# Altium schematic sheet dcshift.SchDoc: Signal Path DC Shift
size A4; Organization: Altium Limited; Address1: L3, 12a Rodborough Rd; Address2: Frenchs Forest; Address3: NSW; Address4: Australia 2086
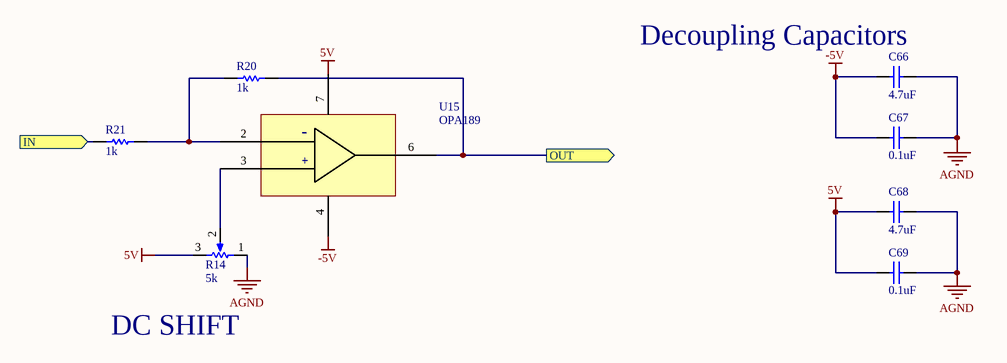
[diagram p0: dcshift.SchDoc]

## Parts
C66  4.7uF  [0402_Cap]
C67  0.1uF  [0402_Cap]
C68  4.7uF  [0402_Cap]
C69  0.1uF  [0402_Cap]
R14  5k  [TRIMPOT]
R20  1k  [0402_Res]
R21  1k  [0402_Res]
U15  OPA189  [SOIC_8]

## Ports
IN (in), OUT (out)

## Nets
5V: C68.1 C69.1 R14.3(BOT) U15.7
-5V: C66.1 C67.1 U15.4
AGND: C66.2 C67.2 C68.2 C69.2 R14.1(TOP)
IN: R21.1 ; port IN
OUT: R20.2 U15.6 ; port OUT
NetR14_2: R14.2(TAP) U15.3
NetR20_1: R20.1 R21.2 U15.2

## Notes on the sheet
- (near C66) Decoupling Capacitors
- DC SHIFT
- Title
- Date:
- RE:
- Arturo di Girolamo
- Size:
- A3
- A
- (in symbol OPA189IDR) -; +

## Library data of the parts
C66 C68 = CL21A475KAQNNNE: Capacitor, 4.7uF, 0805; Value: .01uf; ASYPN: GRM155R61A475MEAAD; MFGPN: CL21A475KAQNNNE
C67 C69 = CL21B104KACNNNC: Capacitor, 0.1uF, 0805; Value: .01uf; ASYPN: 0402YC104KAT2A; MFGPN: CL21B104KACNNNC
R14 = PV36W102C01B00: Potentiometer, 1k; MFGPN: PV36W102C01B00
R20 R21 = RNCP0805FTD1K00: 1K 1% 1/4W; ASYPN: RMCF0402FT1K00; Value: 1K; MFGPN: RNCP0805FTD1K00
U15 = OPA189IDR: Precision OpAmp, Generic; MFGPN: OPA189IDR; ASYPN: OPA189ID